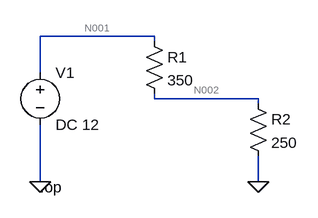
[diagram p0: schematic circuit.asc]
circuit.asc, the LTspice schematic file:
Version 4
SHEET 1 1760 880
SYMBOL voltage 128 136 R0
SYMATTR InstName V1
SYMATTR Value DC 12
SYMBOL res 288 88 R0
SYMATTR InstName R1
SYMATTR Value 350
SYMBOL res 448 184 R0
SYMATTR InstName R2
SYMATTR Value 250
WIRE 128 96 304 96
WIRE 128 152 128 96
WIRE 128 232 128 320
WIRE 304 104 304 96
WIRE 304 184 304 192
WIRE 304 192 464 192
WIRE 464 200 464 192
WIRE 464 280 464 320
FLAG 128 320 0
FLAG 464 320 0
TEXT 128 328 Left 2 !.op

The netlist it stands for:
* circuit.asc
V1 N001 0 DC 12
R1 N001 N002 350
R2 N002 0 250
.op
.backanno
.end

* Results of the author's LTspice run, read from the files saved beside the schematic
* Operating Point:
*   V(n001) = 12 V
*   V(n002) = 5 V
*   I(R1) = 20 mA
*   I(R2) = 20 mA
*   I(V1) = -20 mA